# EasyEDA Pro project ProPrj_DC-DC电源hhh_2025-11-28.epro

# Schematic Schematic1
Board Name: Board1; Create Date: 2025-11-25; Page Name: P1; Project Name: DC-DC电源; Schematic Name: Schematic1; Update Date: 2025-11-26; Company: 嘉立创EDA; Page Size: A4; Version: V1.0
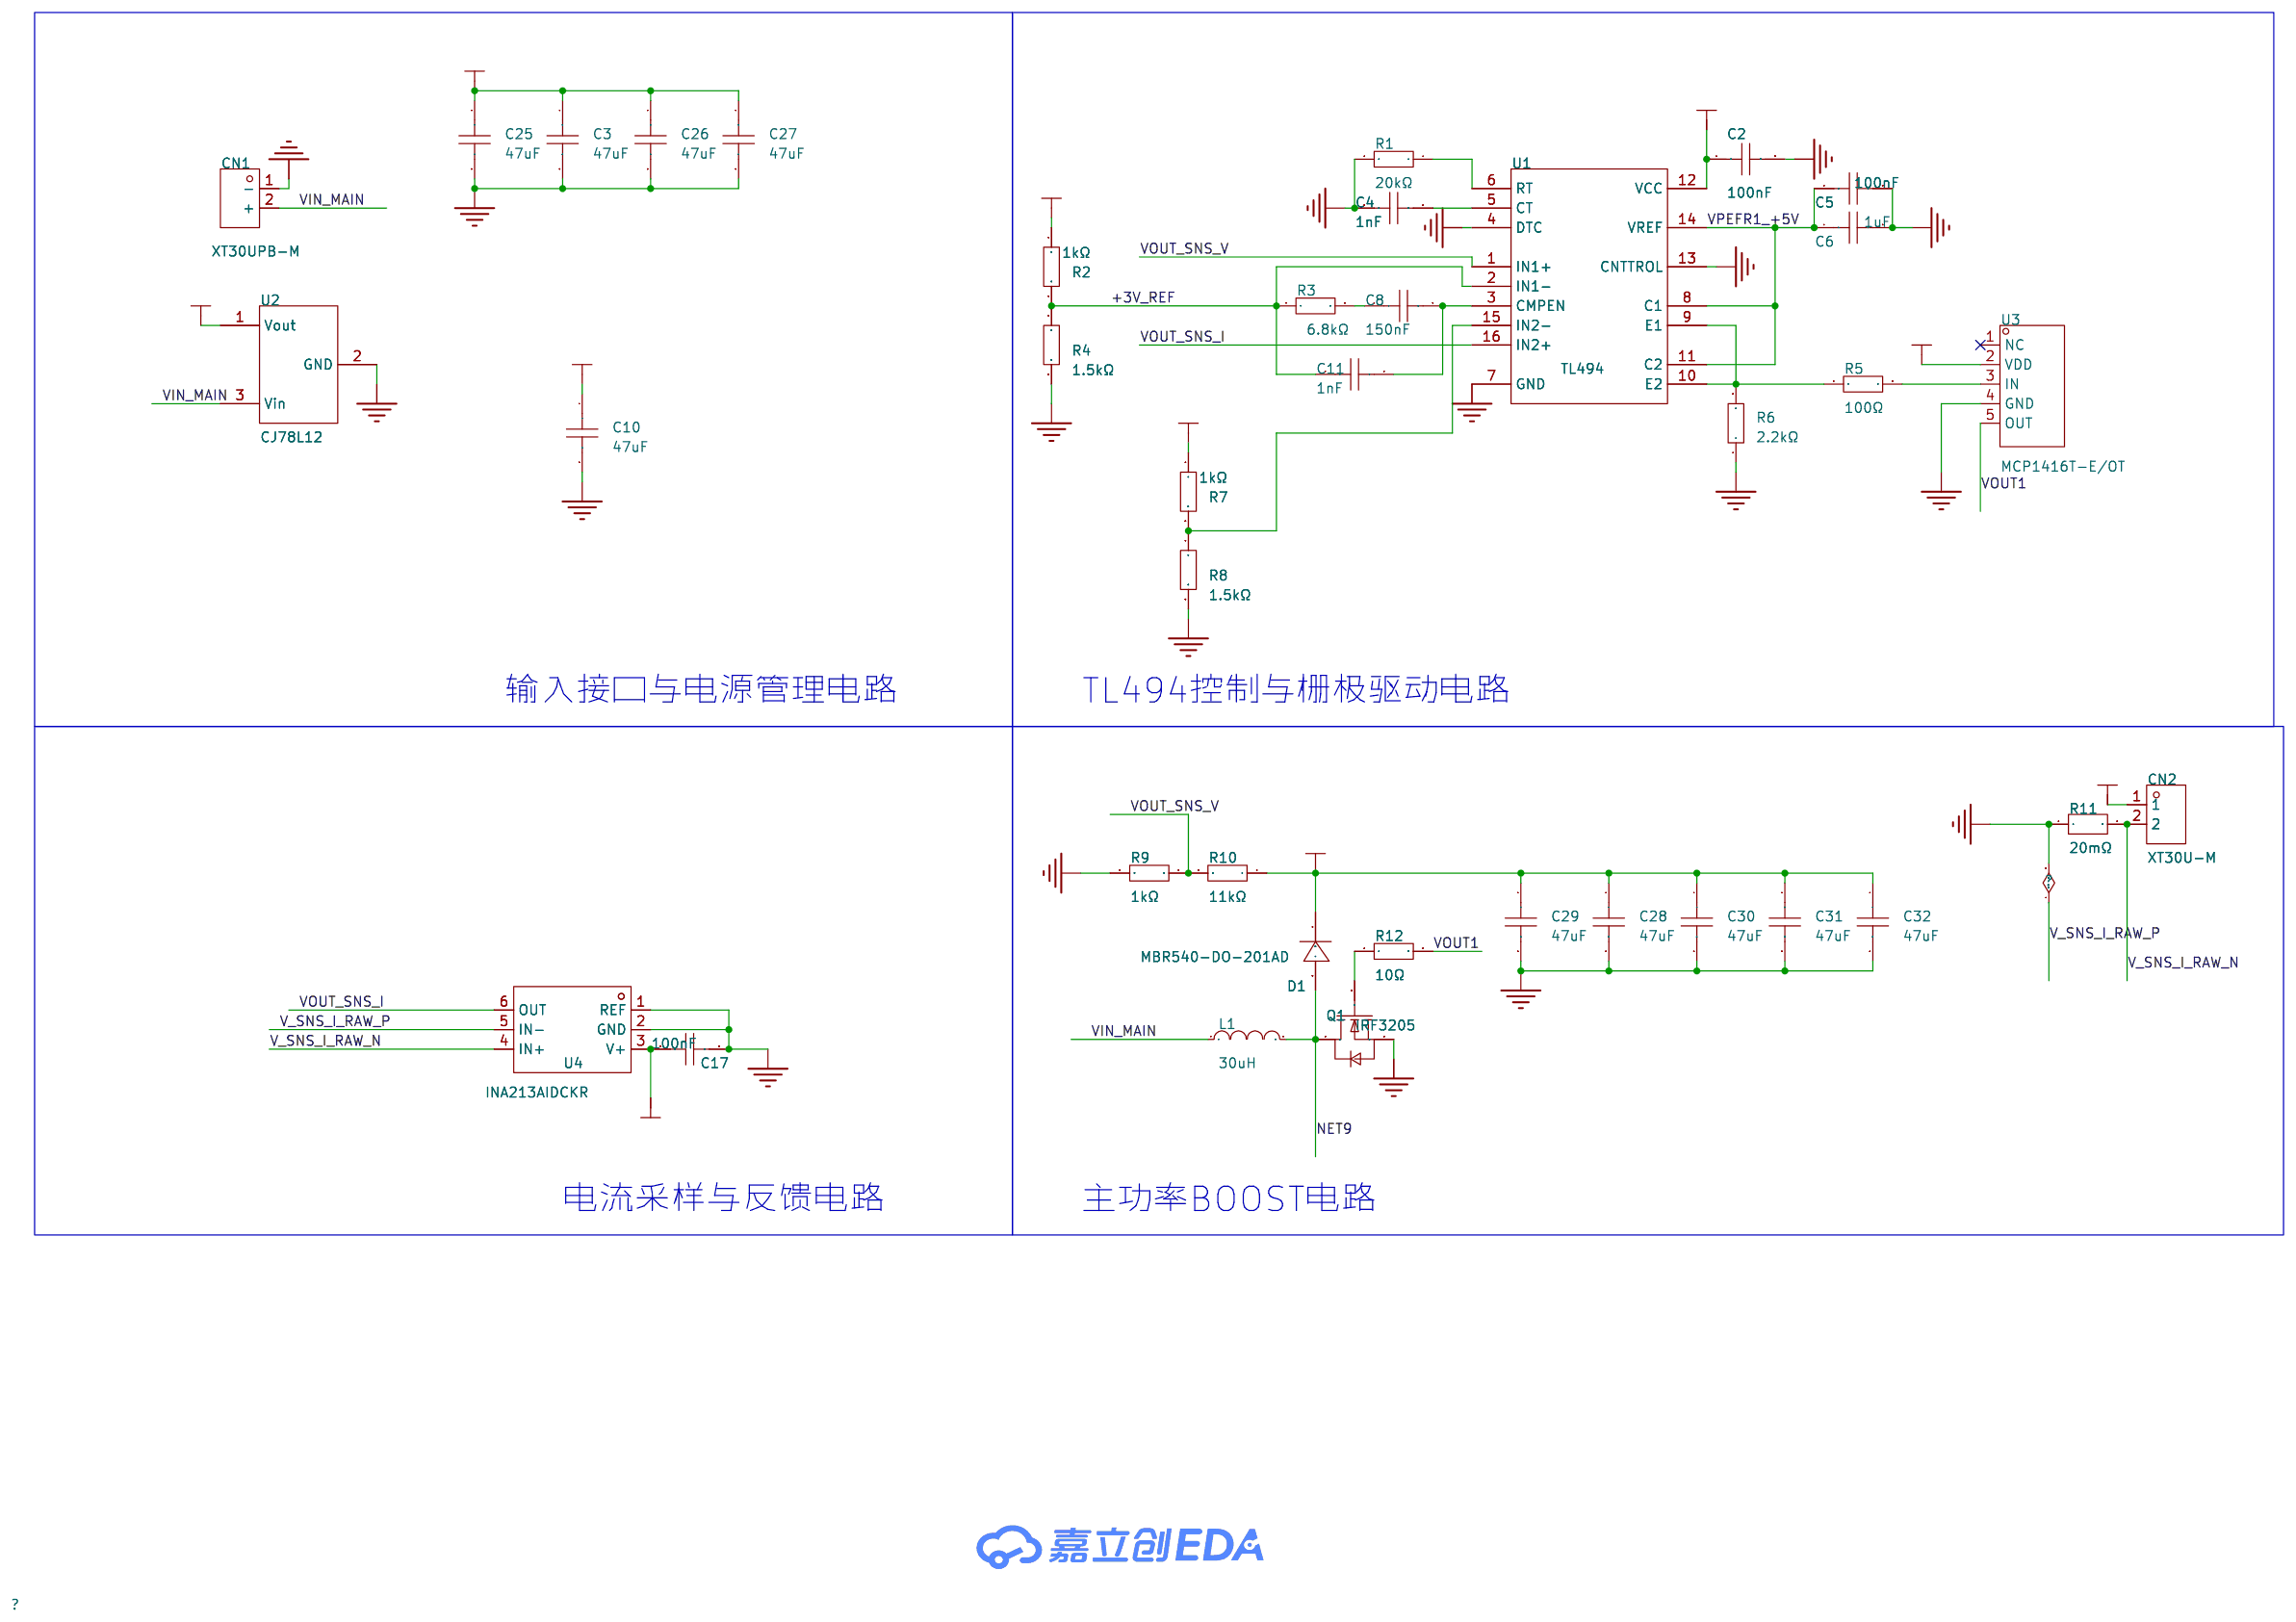
[diagram p0: schematic sheet]

## Parts
C2  100nF  [C0603]
C3  47uF  [C1206]
C4  1nF  [C0603]
C5  100nF  [C0603]
C6  1uF  [C0603]
C8  150nF  [C0603]
C10  47uF  [C1206]
C11  1nF  [C0603]
C17  100nF  [C0603]
C25  47uF  [C1206]
C26  47uF  [C1206]
C27  47uF  [C1206]
C28  47uF  [C1206]
C29  47uF  [C1206]
C30  47uF  [C1206]
C31  47uF  [C1206]
C32  47uF  [C1206]
CN1  XT30UPB-M  [CONN-TH_XT30UPB-M]
CN2  XT30U-M  [CONN-TH_XT30U-M]
D1  MBR540-DO-201AD  [DO-201AD_BD5.3-L8.4-P12.50-D1.4-RD]
L1  30uH  [IND-TH_65125_47UH10A]
Q1  IRF3205  [TO-220-3_L10.0-W4.6-P2.54-L]
R1  20kΩ  [R0603]
R2  1kΩ  [R0603]
R3  6.8kΩ  [R0603]
R4  1.5kΩ  [R0603]
R5  100Ω  [R0603]
R6  2.2kΩ  [R0603]
R7  1kΩ  [R0603]
R8  1.5kΩ  [R0603]
R9  1kΩ  [R0603]
R10  11kΩ  [R0603]
R11  20mΩ  [R1206]
R12  10Ω  [R0603]
U1  TL494  [SOIC-16_L9.9-W3.9-P1.27-LS6.0-BL]
U2  CJ78L12  [SOT-89-3_L4.5-W2.5-P1.50-LS4.2-BR]
U3  MCP1416T-E/OT  [SOT-23-5_L3.0-W1.7-P0.95-LS2.8-BL]
U4  INA213AIDCKR  [TSSOP-6_L2.0-W1.3-P0.65-LS2.0-BR]

## Library data of the parts
C2 C5 C17 = CC0603KRX7R9BB104: 容值:100nF;精度:±10%;额定电压:50V;温度系数:X7R;; LCSC Part Name: 100nF ±10% 50V; Supplier Part: C14663; Manufacturer: YAGEO(国巨); Supplier Footprint: 0603; JLCPCB Part Class: Basic Part; Datasheet: https://item.szlcsc.com/datasheet/CC0603KRX7R9BB104/15331.html; Supplier: LCSC; Tolerance: ±10%; Voltage Rating: 50V; Temperature Coefficient: X7R
C3 C10 C25-C32 = GRM31CR61E476ME44L: 容值:47uF;精度:±20%;额定电压:25V;温度系数:X5R;; LCSC Part Name: 47uF ±20% 25V; Supplier Part: C403725; Manufacturer: muRata(村田); Supplier Footprint: 1206; JLCPCB Part Class: Extended Part; Datasheet: https://item.szlcsc.com/datasheet/GRM31CR61E476ME44L/389810.html; Supplier: LCSC; Tolerance: ±20%; Voltage Rating: 25V; Temperature Coefficient: X5R
C4 = CL10B102KB8NNNC: 容值:1nF;精度:±10%;额定电压:50V;温度系数:X7R;; LCSC Part Name: 1nF ±10% 50V; Supplier Part: C1588; Manufacturer: SAMSUNG(三星); Supplier Footprint: 0603; JLCPCB Part Class: Basic Part; Datasheet: https://item.szlcsc.com/datasheet/CL10B102KB8NNNC/1940.html; Supplier: LCSC; Tolerance: ±10%; Voltage Rating: 50V; Temperature Coefficient: X7R
C6 C8 C11 = CL10A105KB8NNNC: 容值:1uF;精度:±10%;额定电压:50V;温度系数:X5R;; LCSC Part Name: 1uF ±10% 50V; Supplier Part: C15849; Manufacturer: SAMSUNG(三星); Supplier Footprint: 0603; JLCPCB Part Class: Basic Part; Datasheet: https://item.szlcsc.com/datasheet/CL10A105KB8NNNC/16531.html; Supplier: LCSC; Tolerance: ±10%; Voltage Rating: 50V; Temperature Coefficient: X5R
CN1 = XT30UPB-M: 类别:-;类型1:-;; LCSC Part Name: AMASS(艾迈斯)板载立式 航模锂电池控制器连接器插头 公头XT30UPB-M; Supplier Part: C428721; Manufacturer: AMASS(艾迈斯); JLCPCB Part Class: 扩展库; Datasheet: https://item.szlcsc.com/datasheet/XT30UPB-M/423831.html; Supplier: LCSC; Type: 航模插头; Colour: 黄色; RatedVoltage: DC 500V; InterfaceType: 公头; MetalMaterial: 镀金; InsulationMaterial: PA; RatedCurrent: 15A; contact resistance: 0.65mΩ
CN2 = XT30U-M: 类别:-;类型1:-;; LCSC Part Name: AMASS(艾迈斯)轻量版锂电池插头公头 XT30U-M; Supplier Part: C99101; Manufacturer: AMASS(艾迈斯); JLCPCB Part Class: 扩展库; Datasheet: https://item.szlcsc.com/datasheet/XT30U-M/100314.html; Supplier: LCSC; Type: 插头; Colour: 黄色; InterfaceType: 公头
D1 = MBR540-DO-201AD: 正向压降(Vf):580mV@5A;直流反向耐压(Vr):40V;整流电流:5A;; LCSC Part Name: 电压:40V 电流:5A; Supplier Part: C272410; Manufacturer: 吉林华微; Supplier Footprint: DO-201AD; JLCPCB Part Class: 扩展库; Datasheet: https://item.szlcsc.com/datasheet/MBR540-DO-201AD/260932.html; Supplier: LCSC; Voltage - Forward(Vf@If): 580mV@5A; Voltage - DC Reverse(Vr): 40V; Current - Rectified: 5A; Reverse Leakage Current (Ir): 50uA@40V; Non-Repetitive Peak Forward Surge Current: 120A
L1 = L_0603: Supplier Footprint: L0603
Q1 = IRF3205: 数量:1个N沟道;漏源电压(Vdss):55V;连续漏极电流(Id):110A;导通电阻(RDS(on)):9mΩ@10V;耗散功率(Pd):210W;阈值电压(Vgs(th)):4V@250uA;; LCSC Part Name: 1个N沟道 耐压:55V 电流:110A; Supplier Part: C19189952; Manufacturer: minos(迈诺斯); Supplier Footprint: TO-220; JLCPCB Part Class: 扩展库; Datasheet: https://item.szlcsc.com/datasheet/IRF3205/20422303.html; Supplier: LCSC; Number: 1个N沟道; Drain to Source Voltage: 55V; Current - Continuous Drain(Id): 110A; RDS(on): 9mΩ@10V; Pd - Power Dissipation: 210W; Gate Threshold Voltage (Vgs(th)): 4V@250uA; Gate Charge(Qg): 146nC@10V; Input Capacitance(Ciss): 3.247nF@25V; Reverse Transfer Capacitance (Crss@Vds): 211pF@25V; Operating Temperature: -55℃~+175℃; Type: N沟道
R1 = 0603WAF2002T5E: 电阻类型:厚膜电阻;阻值:20kΩ;精度:±1%;功率:100mW;工作电压:75V;温度系数:±100ppm/℃;; LCSC Part Name: 20kΩ ±1% 100mW 厚膜电阻; Supplier Part: C4184; Manufacturer: UNI-ROYAL(厚声); Supplier Footprint: 0603; JLCPCB Part Class: Basic Part; Datasheet: https://item.szlcsc.com/datasheet/0603WAF2002T5E/4591.html; Supplier: LCSC; Type: 厚膜电阻; Tolerance: ±1%; Power(Watts): 100mW; Voltage-Supply(Max): 75V; Temperature Coefficient: ±100ppm/℃; Operating Temperature: -55℃~+155℃
R2 R7 = 0603WAF1002T5E: 电阻类型:厚膜电阻;阻值:10kΩ;精度:±1%;功率:100mW;工作电压:75V;温度系数:±100ppm/℃;; LCSC Part Name: 厚膜电阻 10kΩ ±1% 100mW; Supplier Part: C25804; Manufacturer: UNI-ROYAL(厚声); Supplier Footprint: 0603; JLCPCB Part Class: Basic Part; Datasheet: https://item.szlcsc.com/datasheet/0603WAF1002T5E/26547.html; Supplier: LCSC; Type: 厚膜电阻; Tolerance: ±1%; Power(Watts): 100mW; Voltage-Supply(Max): 75V; Temperature Coefficient: ±100ppm/℃; Operating Temperature: -55℃~+155℃
R3 R12 = 0603WAF100JT5E: 电阻类型:厚膜电阻;阻值:10Ω;精度:±1%;功率:100mW;工作电压:75V;温度系数:±400ppm/℃;; LCSC Part Name: 10Ω ±1% 100mW 厚膜电阻; Supplier Part: C22859; Manufacturer: UNI-ROYAL(厚声); Supplier Footprint: 0603; JLCPCB Part Class: Basic Part; Datasheet: https://item.szlcsc.com/datasheet/0603WAF100JT5E/23586.html; Supplier: LCSC; Type: 厚膜电阻; Tolerance: ±1%; Power(Watts): 100mW; Voltage-Supply(Max): 75V; Temperature Coefficient: ±400ppm/℃; Operating Temperature: -55℃~+155℃
R4 R8 = 0603WAF1502T5E: 电阻类型:厚膜电阻;阻值:15kΩ;精度:±1%;功率:100mW;工作电压:75V;温度系数:±100ppm/℃;; LCSC Part Name: 15kΩ ±1% 100mW 厚膜电阻; Supplier Part: C22809; Manufacturer: UNI-ROYAL(厚声); Supplier Footprint: 0603; JLCPCB Part Class: Basic Part; Datasheet: https://item.szlcsc.com/datasheet/0603WAF1502T5E/23536.html; Supplier: LCSC; Type: 厚膜电阻; Tolerance: ±1%; Power(Watts): 100mW; Voltage-Supply(Max): 75V; Temperature Coefficient: ±100ppm/℃; Operating Temperature: -55℃~+155℃
R5 = 0603WAF1000T5E: 电阻类型:厚膜电阻;阻值:100Ω;精度:±1%;功率:100mW;最大工作电压:75V;温度系数:±200ppm/℃;; LCSC Part Name: 100Ω ±1% 100mW 厚膜电阻; Supplier Part: C22775; Manufacturer: UNI-ROYAL(厚声); Supplier Footprint: 0603; JLCPCB Part Class: Basic Part; Datasheet: https://atta.szlcsc.com/upload/public/pdf/source/20200306/C422600_1E6D84923E4A46A82E41ADD87F860B5C.pdf; Supplier: LCSC; Type: 厚膜电阻; Tolerance: ±1%; Power(Watts): 100mW; Overload Voltage (Max): 75V; Temperature Coefficient: ±200ppm/℃; Operating Temperature Range: -55℃~+155℃
R6 = 0603WAF2201T5E: 电阻类型:厚膜电阻;阻值:2.2kΩ;精度:±1%;功率:100mW;最大工作电压:75V;温度系数:±100ppm/℃;; LCSC Part Name: 2.2kΩ ±1% 100mW 厚膜电阻; Supplier Part: C4190; Manufacturer: UNI-ROYAL(厚声); Supplier Footprint: 0603; JLCPCB Part Class: Basic Part; Datasheet: https://atta.szlcsc.com/upload/public/pdf/source/20200306/C422600_1E6D84923E4A46A82E41ADD87F860B5C.pdf; Supplier: LCSC; Type: 厚膜电阻; Tolerance: ±1%; Power(Watts): 100mW; Overload Voltage (Max): 75V; Temperature Coefficient: ±100ppm/℃; Operating Temperature Range: -55℃~+155℃
R9 = 0603WAF1001T5E: 电阻类型:厚膜电阻;阻值:1kΩ;精度:±1%;功率:100mW;工作电压:75V;温度系数:±100ppm/℃;; LCSC Part Name: 1kΩ ±1% 100mW 厚膜电阻; Supplier Part: C21190; Manufacturer: UNI-ROYAL(厚声); Supplier Footprint: 0603; JLCPCB Part Class: Basic Part; Datasheet: https://item.szlcsc.com/datasheet/0603WAF1001T5E/21904.html; Supplier: LCSC; Type: 厚膜电阻; Tolerance: ±1%; Power(Watts): 100mW; Voltage-Supply(Max): 75V; Temperature Coefficient: ±100ppm/℃; Operating Temperature: -55℃~+155℃
R10 = 0603WAF1102T5E: 电阻类型:厚膜电阻;阻值:11kΩ;精度:±1%;功率:100mW;工作电压:75V;温度系数:±100ppm/℃;; LCSC Part Name: 11kΩ ±1% 100mW 厚膜电阻; Supplier Part: C25950; Manufacturer: UNI-ROYAL(厚声); Supplier Footprint: 0603; JLCPCB Part Class: Extended Part; Datasheet: https://item.szlcsc.com/datasheet/0603WAF1102T5E/26693.html; Supplier: LCSC; Type: 厚膜电阻; Tolerance: ±1%; Power(Watts): 100mW; Voltage-Supply(Max): 75V; Temperature Coefficient: ±100ppm/℃; Operating Temperature: -55℃~+155℃
R11 = JER1206F1R020: 电阻类型:采样电阻；合金电阻;阻值:20mΩ;精度:±1%;功率:1W;温度系数:±50ppm/℃;; LCSC Part Name: 20mΩ 1W 1206 ±1%; Supplier Part: C46634440; Manufacturer: JIERR(捷而瑞); Supplier Footprint: 1206; JLCPCB Part Class: 扩展库; Datasheet: https://item.szlcsc.com/datasheet/JER1206F1R020/48788242.html; Supplier: LCSC; Type: 采样电阻；合金电阻; Tolerance: ±1%; Power(Watts): 1W; Temperature Coefficient: ±50ppm/℃
U1 = TL494_C5356108: 功能类型:-;输出类型:-;工作电压:-;输出电压:-;输出电流:-;; LCSC Part Name: PWM开关调节器控制器; Supplier Part: C5356108; Manufacturer: JSMSEMI(杰盛微); Supplier Footprint: SOP-16; JLCPCB Part Class: 扩展库; Datasheet: https://atta.szlcsc.com/upload/public/pdf/source/20240105/34213FA36E6C5EE3D425F21E5501E2DC.pdf; Supplier: LCSC; Switching Frequency: 1kHz~300kHz; Operating Temperature: 0℃~+70℃; Synchronous Rectification: 否
U2 = CJ78L12_C8615: 输出类型:固定;工作电压:35V;输出电压:12V;输出电流:100mA;电源纹波抑制比(PSRR):42dB@(120Hz);输出极性:正极;; LCSC Part Name: 输入35V 输出12V 100mA; Supplier Part: C8615; Manufacturer: CJ(江苏长电/长晶); Supplier Footprint: SOT-89-3L; JLCPCB Part Class: 扩展库; Datasheet: https://atta.szlcsc.com/upload/public/pdf/source/20140508/1457707058232.pdf; Supplier: LCSC; Output Type: 固定; Voltage - Supply: 35V; Output Voltage: 12V; Output Current: 100mA; Power Supply Rejection Ratio (PSRR): 42dB@(120Hz); Voltage Dropout: 1.7V@(40mA); standby current: 4.3mA; Noise: 70uV; Operating Temperature: 0℃~+150℃@(Tj); Output Configuration: 正极; Number of Outputs: 1
U3 = MCP1416T-E/OT: 驱动配置:低边;负载类型:MOSFET；IGBT;驱动通道数:1;峰值灌电流:1.5A;峰值拉电流:1.5A;电源电压:4.5V~18V;上升时间:20ns;下降时间:20ns;; Supplier Part: C83775; Manufacturer: MICROCHIP(美国微芯); Supplier Footprint: SOT-23-5; JLCPCB Part Class: 扩展库; Datasheet: https://atta.szlcsc.com/upload/public/pdf/source/20170606/1496716520900.pdf; Supplier: LCSC; Driven Configuration: 低边; Load Type: MOSFET；IGBT; Number of Drivers: 1; Peak Output Current(sink): 1.5A; Peak Output Current(source): 1.5A; Supply Voltage: 4.5V~18V; Rise Time: 20ns; Fall Time: 20ns; Operating Temperature: -40℃~+150℃@(Tj)
U4 = INA213AIDCKR: 放大器数:单路;; LCSC Part Name: 低侧或高侧测量，双向零漂移电流检测放大器; Supplier Part: C129346; Manufacturer: TI(德州仪器); Supplier Footprint: SC-70-6; JLCPCB Part Class: 扩展库; Datasheet: https://www.ti.com/cn/lit/gpn/ina213; Supplier: LCSC; Number of Channels: 单路; Supply Current: 65uA; Operating Temperature: -40℃~+125℃

## Nets
+3V_REF: C11.1 R2.2 R3.1 R4.1 U1.2(IN1-)
+12V: C2.1 C10.1 C17.1 U1.12(VCC) U2.1(Vout) U3.2(VDD) U4.3(V+)
GND: C2.2 C3.2 C4.2 C5.2 C6.2 C10.2 C17.2 C25.2 C26.2 C27.2 C28.2 C29.2 C30.2 C31.2 C32.2 CN1.1(-) Q1.3(S) R1.2 R4.2 R6.1 R8.2 R9.2 R11.1 U1.4(DTC) U1.7(GND) U1.13(CNTTROL) U2.2(GND) U3.4(GND) U4.1(REF) U4.2(GND) U4.5(IN-)
VIN_MAIN: C3.1 C25.1 C26.1 C27.1 CN1.2(+) L1.1 U2.3(Vin)
NET9: D1.2(A) L1.2 Q1.2(D)
V_SNS_I_RAW_N: CN2.2 R11.2 U4.4(IN+)
VOUT1: R12.2 U3.5(OUT)
VOUT+: C28.1 C29.1 C30.1 C31.1 C32.1 CN2.1 D1.1(C) R10.1
VOUT_SNS_I: U1.16(IN2+) U4.6(OUT)
VOUT_SNS_V: R9.1 R10.2 U1.1(IN1+)
VPEFR1_+5V: C5.1 C6.1 R2.1 R7.1 U1.8(C1) U1.11(C2) U1.14(VREF)
$6N6240: Q1.1(G) R12.1
$6N18799: R5.1 R6.2 U1.9(E1) U1.10(E2)
$6N18924: R5.2 U3.3(IN)
$6N22408: C4.1 U1.5(CT)
$6N22426: R1.1 U1.6(RT)
$6N22512: C8.1 R3.2
$6N22632: C8.2 C11.2 U1.3(CMPEN)
$6N22646: R7.2 R8.1 U1.15(IN2-)

Not connected (* = marked no-connect by the designer): U3 1(NC)*

## Notes on the sheet
- 输入接口与电源管理电路
- TL494控制与栅极驱动电路
- 电流采样与反馈电路
- 主功率BOOST电路

# Board PCB1
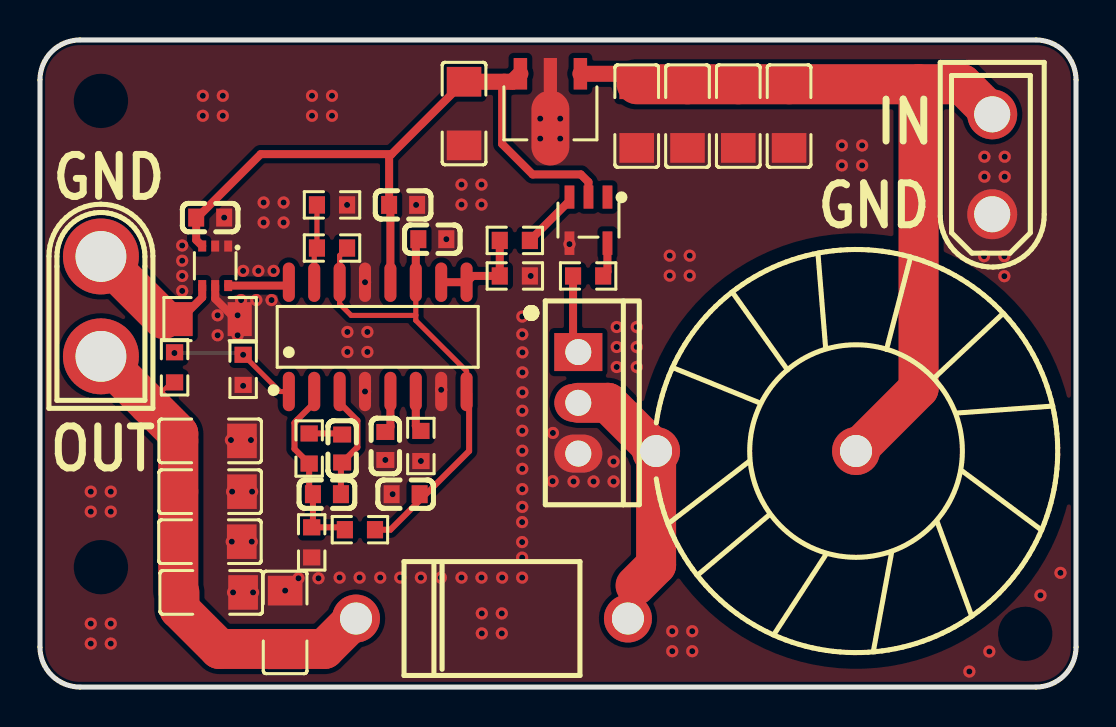
[diagram p1: board, top side]
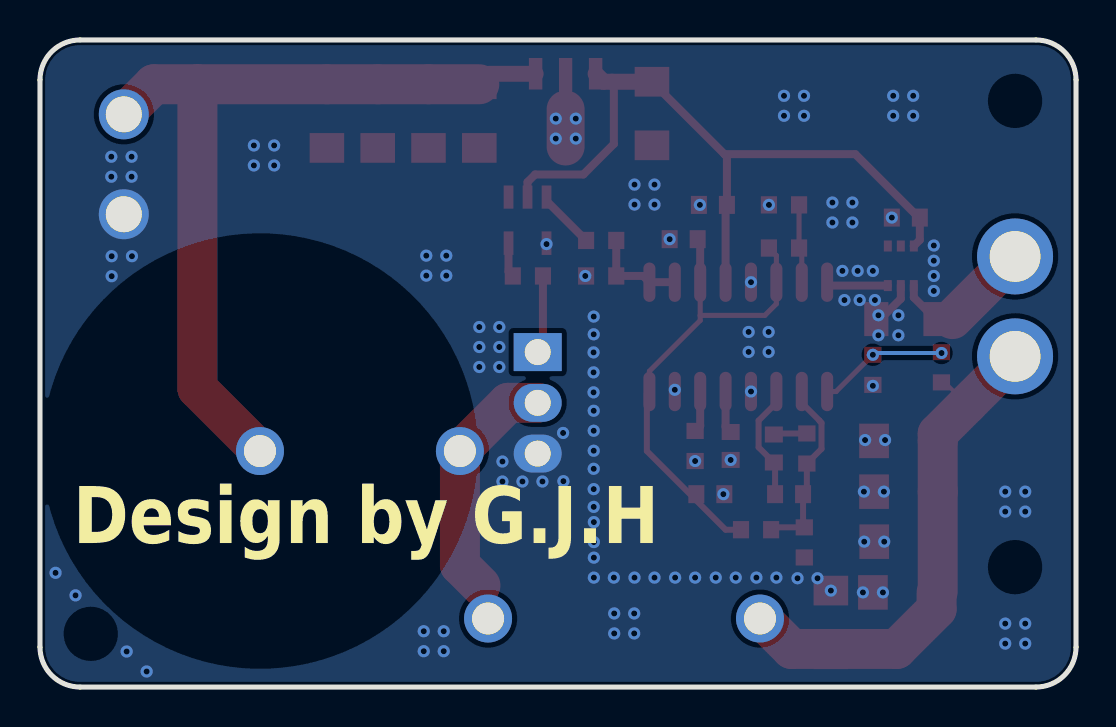
[diagram p2: board, bottom side, seen from below]

Outline 51.82 x 32.39 mm; copper layers: Top Layer, Bottom Layer. Coordinates in mm from the lower left corner of the outline.
Outline path: 0,30.39 0,2 arc(0.59,0.59) 2,0 49.82,0 arc(51.23,0.59) 51.82,2 51.82,30.39 arc(51.23,31.8) 49.82,32.39 2,32.39 arc(0.59,31.8) 0,30.39
Stack: Top Layer 0.035mm / Dielectric1 1.51mm FR4 er 4.5 / Bottom Layer 0.035mm

## Design rules (mm)
template: 自定义配置
spacing copperThickness1oz (default): track to track 0.102, other pairs 0.152 to 0.3
spacing copperThickness2oz: track to track 0.203, other pairs 0.152 to 0.3
track width copperThickness1oz (default): min 0.127, default 0.254, max 2.54
track width copperThickness2oz: min 0.203, default 0.254, max 2.54
track width trackWidth1: min 0.127, default 0.254, max 2.54
differential pair differentialPair (default): width min 0.127, default 0.254, max 2.54; gap min 0.152, default 0.152
differential pair differentialPair1: width min 0.127, default 0.254, max 2.54; gap min 0.152, default 0.152
via viaSize (default): diameter min 0.5, default 0.61, max 10; hole min 0.3, default 0.305, max 6.3
via viaSize1: diameter min 0.5, default 0.61, max 10; hole min 0.3, default 0.305, max 6.3

## Placement (name value [footprint] x y rotation side)
C2  100nF  [C0603]  18.16 24.13 0 top
C3  47uF  [C1206]  29.85 28.58 270 top
C4  1nF  [C0603]  17.27 12.06 270 top
C5  100nF  [C0603]  18.29 9.65 180 top
C6  1uF  [C0603]  19.62 22.41 0 top
C8  150nF  [C0603]  15.11 11.94 270 top
C10  47uF  [C1206]  21.21 28.7 270 top
C11  1nF  [C0603]  14.35 9.65 0 top
C17  100nF  [C0603]  8.51 23.5 0 top
C25  47uF  [C1206]  34.92 28.58 270 top
C26  47uF  [C1206]  37.47 28.58 270 top
C27  47uF  [C1206]  32.39 28.58 270 top
C28  47uF  [C1206]  8.51 9.78 0 top
C29  47uF  [C1206]  8.51 12.32 0 top
C30  47uF  [C1206]  8.5 7.28 0 top
C31  47uF  [C1206]  8.56 4.74 0 top
C32  47uF  [C1206]  12.26 3.23 90 top
CN1  XT30UPB-M  [CONN-TH_XT30UPB-M]  47.63 26.16 90 top
CN2  XT30U-M  [CONN-TH_XT30U-M]  3.05 19.05 90 top
D1  MBR540-DO-201AD  [DO-201AD_BD5.3-L8.4-P12.50-D1.4-RD]  22.61 3.43 0 top
L1  30uH  [IND-TH_65125_47UH10A]  35.81 11.81 180 top
Q1  IRF3205  [TO-220-3_L10.0-W4.6-P2.54-L]  26.92 14.22 270 top
R1  20kΩ  [R0603]  19.05 12.06 270 top
R2  1kΩ  [R0603]  16 7.87 180 top
R3  6.8kΩ  [R0603]  13.46 11.94 90 top
R4  1.5kΩ  [R0603]  13.59 7.24 270 top
R5  100Ω  [R0603]  23.75 22.35 0 top
R6  2.2kΩ  [R0603]  23.75 20.57 180 top
R7  1kΩ  [R0603]  14.61 21.97 180 top
R8  1.5kΩ  [R0603]  14.61 24.13 0 top
R9  1kΩ  [R0603]  10.16 15.88 270 top
R10  11kΩ  [R0603]  6.73 16 90 top
R11  20mΩ  [R1206]  8.51 18.42 180 top
R12  10Ω  [R0603]  27.41 20.57 0 top
U1  TL494  [SOIC-16_L9.9-W3.9-P1.27-LS6.0-BL]  16.89 17.53 0 top
U2  CJ78L12  [SOT-89-3_L4.5-W2.5-P1.50-LS4.2-BR]  25.53 29.34 90 top
U3  MCP1416T-E/OT  [SOT-23-5_L3.0-W1.7-P0.95-LS2.8-BL]  27.43 23.37 180 top
U4  INA213AIDCKR  [TSSOP-6_L2.0-W1.3-P0.65-LS2.0-BR]  8.76 21.08 90 top

## Footprints (pads in the part's own frame, mm; a bottom-side part is the same pattern mirrored in y, then rotated)
C0603
  rect 0.8x0.9 smd: 1(-0.7,0) 2(0.7,0)
C1206
  rect 1.485x1.728 smd: 1(-1.593,0) 2(1.593,0)
CONN-TH_XT30U-M
  round 3.8 hole 2.54: 1(-2.5,0) 2(2.5,0)
CONN-TH_XT30UPB-M
  round 2.5 hole 1.8: 1(-2.5,0) 2(2.5,0)
DO-201AD_BD5.3-L8.4-P12.50-D1.4-RD
  round 2.4 hole 1.6: 1(-6.8,0) 2(6.8,0)
IND-TH_65125_47UH10A
  round 2.4 hole 1.6: 1(-5,0) 2(5,0)
R0603
  rect 0.806x0.864 smd: 1(-0.753,0) 2(0.753,0)
R1206
  rect 1.208x1.701 smd: 1(-1.479,0) 2(1.479,0)
SOIC-16_L9.9-W3.9-P1.27-LS6.0-BL
  oval 0.602x1.971 smd: 1(-4.445,-2.736) 2(-3.175,-2.736) 3(-1.905,-2.736) 4(-0.635,-2.736) 5(0.635,-2.736) 6(1.905,-2.736) 7(3.175,-2.736) 8(4.445,-2.736) 9(4.445,2.736) 10(3.175,2.736) 11(1.905,2.736) 12(0.635,2.736) 13(-0.635,2.736) 14(-1.905,2.736) 15(-3.175,2.736) 16(-4.445,2.736)
SOT-23-5_L3.0-W1.7-P0.95-LS2.8-BL
  rect 0.49x1.157 smd: 1(-0.95,-1.153) 2(0,-1.153) 3(0.95,-1.153)
  rect 0.49x1.175 smd: 4(0.95,1.153) 5(-0.95,1.153)
SOT-89-3_L4.5-W2.5-P1.50-LS4.2-BR
  rect 1.575x0.672 smd: 1(1.356,-1.5) 3(1.356,1.5)
  custom 5.377x1.9 smd: 2(-1.356,0)
TO-220-3_L10.0-W4.6-P2.54-L
  rect 1.9x2.4 hole 1.3: 1(-2.54,0)
  oval 1.9x2.4 hole 1.3: 2(0,0) 3(2.54,0)
TSSOP-6_L2.0-W1.3-P0.65-LS2.0-BR
  rect 0.551x0.399 smd: 1(0.991,-0.65) 2(0.991,0) 3(0.991,0.65) 4(-0.991,0.65) 5(-0.991,0) 6(-0.991,-0.65)

## Nets
As in the schematic, except:
+12V: C2.1 C10.1 C17.1 U1.12 U2.3 U3.2 U4.3
VIN_MAIN: C3.1 C25.1 C26.1 C27.1 CN1.2 L1.1 U2.1

Pads without a net: U3 1

## Via types
v1: diameter 0.61, hole 0.305, Top Layer to Bottom Layer, 135 vias

## Routing (per net, layer and track width the routed paths; a pad name or vN(x,y) marks a point on that pad's centre or on a via; arc(x,y) is an arc through that point)
+3V_REF: length 9.3
  Top Layer w0.3: R2.2 15.13,7.99 R4.1 13.65,8.05 C11.1 13.46,9.84 R3.1 12.73,11.92 12.73,13.22 12.83,13.32 12.83,13.34 13.72,14.22 U1.2
+12V: length 36.2
  Top Layer w0.4: C10.1 17.58,26.67 ; 17.58,26.67 11.04,26.67 7.86,23.5 C17.1 7.81,22.37 U4.3 ; 17.58,26.67 17.46,26.55 17.46,24.13 17.53,24.06 U1.12 ; U3.2 27.43,25.27 27.05,25.65 24.64,25.65 23.11,27.18 23.11,30.19 23.22,30.29
  Top Layer w0.8: C10.1 23.63,30.29 U2.3
GND: length 2.3
  Top Layer w0.4: R11.1 9.78,18.42 8.76,19.43 U4.5
  vias: v1(2.54,9.78) v1(2.54,8.78) v1(2.54,3.17) v1(2.54,2.17) v1(3.54,9.78) v1(3.54,8.78) v1(3.54,3.17) v1(3.54,2.17) v1(7.11,22.1) v1(7.11,21.34) v1(7.11,20.57) v1(7.11,19.82) v1(8.14,29.59) v1(8.14,28.59) v1(8.88,18.61) v1(8.88,17.61) v1(9.14,29.59) v1(9.14,28.59) v1(9.21,23.5) v1(9.55,12.36) v1(9.61,9.78) v1(9.59,7.28) v1(9.66,4.74) v1(9.88,18.61) v1(9.88,17.61) v1(10.06,19.37) v1(10.16,20.83) v1(10.16,15.08) v1(10.55,12.36) v1(10.61,9.78) v1(10.59,7.28) v1(10.66,4.74) v1(10.82,19.37) v1(10.92,20.83) v1(11.18,24.25) v1(11.18,23.25) v1(11.58,19.37) v1(11.68,20.83) v1(12.18,24.25) v1(12.18,23.25) v1(12.26,4.83) v1(12.93,5.44) v1(13.61,29.59) v1(13.61,28.59) v1(13.93,5.44) v1(14.61,29.59) v1(14.61,28.59) v1(14.99,5.48) v1(15.36,24.13) v1(15.38,17.77) v1(15.38,16.77) v1(15.99,5.48) v1(16.26,20.26) v1(16.26,14.79) v1(16.38,17.77) v1(16.38,16.77) v1(17.02,5.48) v1(17.27,11.36) v1(17.64,9.65) v1(18.02,5.48) v1(18.81,24.13) v1(19.05,11.31) v1(19.05,5.48) v1(20.07,14.88) v1(20.05,5.48) v1(20.32,22.41) v1(21.08,25.15) v1(21.08,24.15) v1(21.08,5.48) v1(22.08,25.15) v1(22.08,24.15) v1(22.08,5.48) v1(22.1,3.68) v1(22.1,2.68) v1(23.11,5.48) v1(23.1,3.68) v1(23.1,2.68) v1(24.12,18.54) v1(24.12,17.65) v1(24.13,16.75) v1(24.13,15.75) v1(24.13,14.75) v1(24.12,13.83) v1(24.12,12.83) v1(24.12,11.83) v1(24.12,10.92) v1(24.12,9.91) v1(24.12,9.02) v1(24.11,8.25) v1(24.11,7.25) v1(24.11,6.48) v1(24.11,5.48) v1(24.54,20.57) v1(25.02,28.45) v1(25.02,27.45) v1(25.65,12.72) v1(25.64,10.3) v1(26.02,28.45) v1(26.02,27.45) v1(26.48,22.17) v1(26.69,10.29) v1(27.69,10.29) v1(28.69,11.29) v1(28.69,10.29) v1(28.85,18.02) v1(28.85,17.02) v1(28.85,16.02) v1(29.85,18.02) v1(29.85,17.02) v1(29.85,16.02) v1(31.5,21.59) v1(31.5,20.59) v1(31.62,2.79) v1(31.62,1.79) v1(32.5,21.59) v1(32.5,20.59) v1(32.62,2.79) v1(32.62,1.79) v1(40.11,27.11) v1(40.11,26.11) v1(41.12,27.11) v1(41.12,26.11) v1(46.48,0.78) v1(47.24,26.54) v1(47.24,25.54) v1(47.22,21.56) v1(47.48,1.78) v1(48.25,26.54) v1(48.25,25.54) v1(48.23,21.56) v1(48.23,20.56) v1(50.04,4.59) v1(51.04,5.72)
VIN_MAIN: length 40.3
  Top Layer w0.8: U2.1 29.32,30.69
  Top Layer w2: 43.94,30.17 46.12,30.17 CN1.2 ; 43.94,30.17 C26.1 C25.1 C27.1 C3.1 ; 43.94,30.17 43.94,14.94 L1.1
NET9: length 12
  Top Layer w2: Q1.2 28.4,14.22 L1.2 30.81,6.11 29.79,5.08
V_SNS_I_RAW_N: length 6.6
  Top Layer w0.4: U4.4 8.11,19.5 R11.2
  Top Layer w2: CN2.2 6.18,18.42
VOUT1: length 1.7
  Top Layer w0.4: U3.5 28.38,20.79 R12.2
VOUT+: length 26.2
  Top Layer w0.2: R10.1 6.56,15.25 5.45,14.14
  Top Layer w2: 6.92,4.79 C28.1 C29.1 6.92,12.68 CN2.1 ; C31.1 6.97,3.91 8.97,1.91 14.22,1.91 15.81,3.49
VOUT_SNS_I: length 3.1
  Top Layer w0.4: U1.16 12.28,20.09 9.41,20.09
VOUT_SNS_V: length 6.5
  Top Layer w0.254: v1(10.16,16.63) 12,14.79 U1.1
  Bottom Layer w0.2: v1(10.16,16.63) 10.07,16.72 v1(6.72,16.72)
VPEFR1_+5V: length 25.1
  Top Layer w0.254: 18.8,18.6 18.8,18.35 21.34,15.81 U1.8 ; 18.8,18.6 U1.11 ; 18.8,18.6 15.56,18.6 14.99,19.18 U1.14 14.99,21.6 R7.1
  Top Layer w0.3: R2.1 17.53,7.87 21.46,11.81 21.46,14.66 U1.8
  Top Layer w0.4: U1.11 18.8,22.29 C6.1
$6N6240: length 3.9
  Top Layer w0.4: 26.66,20.57 26.66,17.03 Q1.1
$6N18799: length 4.8
  Top Layer w0.4: R5.1 R6.2 21.65,20.57 U1.9 U1.10
$6N18924: length 3
  Top Layer w0.4: R5.2 26.48,24.33 U3.3
$6N22408: length 2.1
  Top Layer w0.4: U1.5 17.53,13.02 C4.1
$6N22426: length 2.1
  Top Layer w0.4: R1.1 18.8,13.07 U1.6
$6N22512: length 1.7
  Top Layer w0.3: C8.1 15.06,12.69 R3.2
$6N22632: length 5.8
  Top Layer w0.3: U1.3 14.99,14.22 15.88,13.34 15.88,12 C8.2 15.05,11.18 C11.2
$6N22646: length 3.9
  Top Layer w0.254: R8.1 R7.2 13.72,21.84 U1.15

## Copper pours and planes (outline as drawn; the poured copper is in the pictures)
GND on Top Layer: -7.24,35.05 59.05,35.05 59.05,-2.54 -7.24,-2.54
GND on Bottom Layer: -3.17,40.77 55.12,40.77 55.12,-7.24 -3.17,-7.24

## Text on the board
Bottom Silkscreen Layer: Design by G.J.H
Top Silkscreen Layer: OUT | GND | IN
